# Altium project PCB_Project.PrjPcb
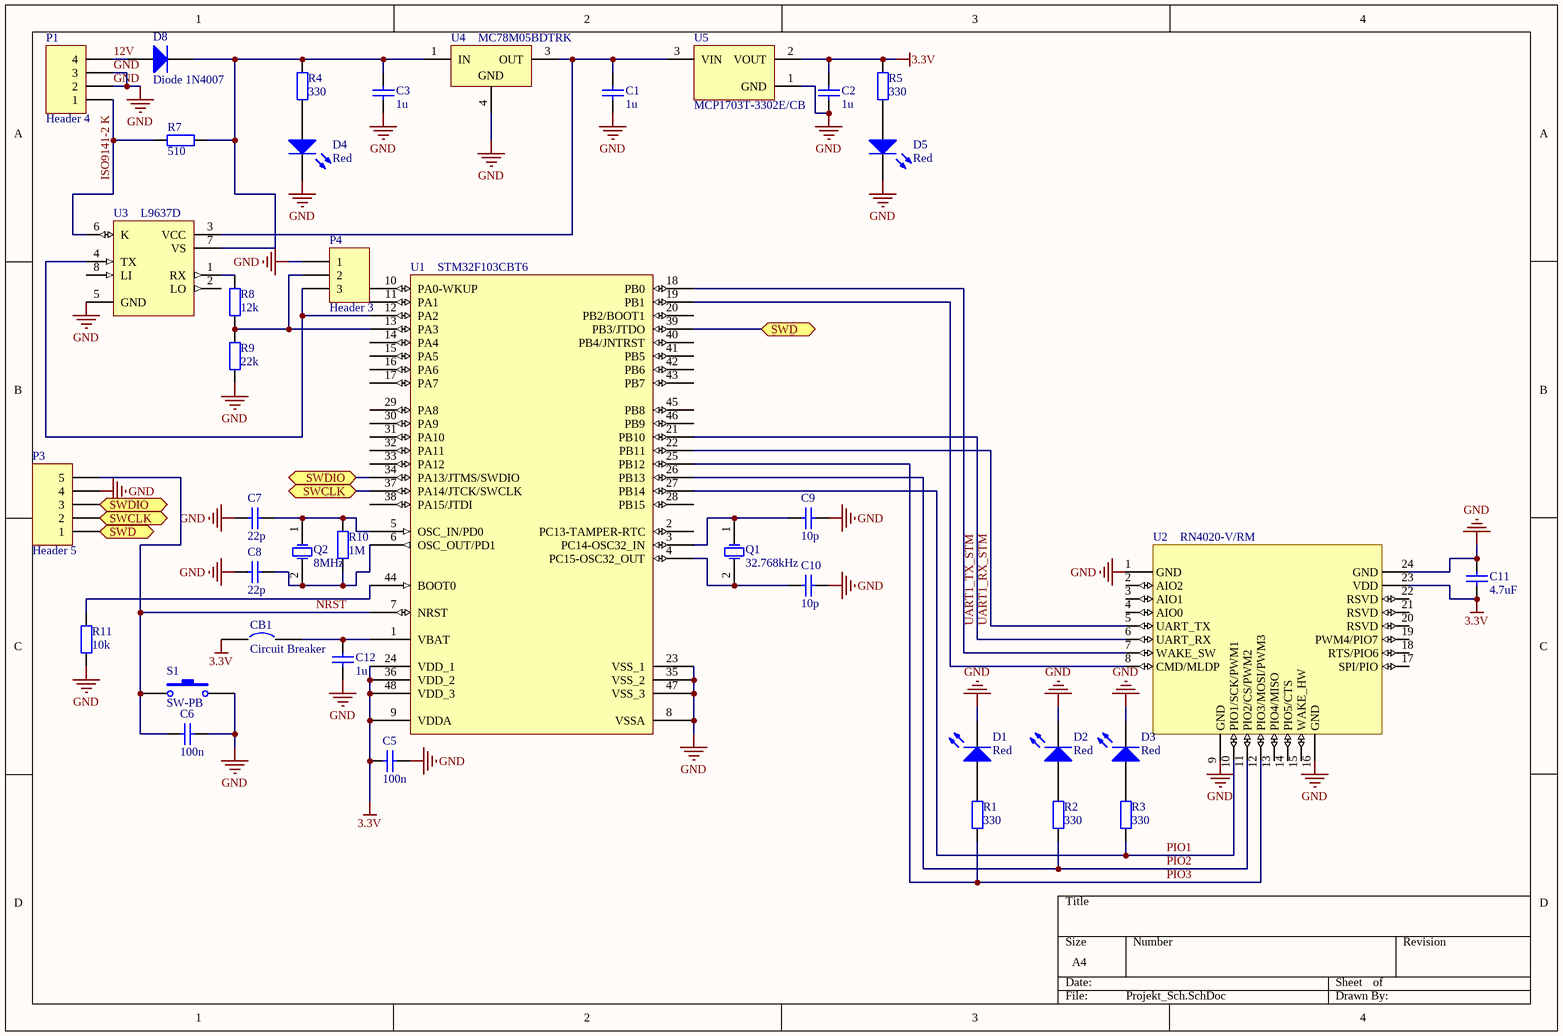
[diagram p0: Projekt_Sch.SchDoc]
1 sheet, 39 parts. Net scope: flat (ports and power ports of the same name join across sheets).
Board file: Projekt_Pcb.PcbDoc

## Sheet Projekt_Sch.SchDoc
size A4

### Parts
C1  1u  [0402]
C2  1u  [0402]
C3  1u  [0603]
C5  100n  [0402]
C6  100n  [0402]
C7  22p  [0402]
C8  22p  [0402]
C9  10p  [0402]
C10  10p  [0402]
C11  4.7uF  [0402]
C12  1u  [0402]
CB1  Circuit Breaker  [SPST-2]
D1  Red  [0402]
D2  Red  [0402]
D3  Red  [0402]
D4  Red  [0402]
D5  Red  [0402]
D8  Diode 1N4007  [DO-41]
P1  Header 4  [HDR1X4]
P3  Header 5  [HDR1X5]
P4  Header 3  [HDR1X3]
Q1  32.768kHz  [Kwarc]
Q2  8MHz  [HC-49U]
R1  330  [0402]
R2  330  [0402]
R3  330  [0402]
R4  330  [0402]
R5  330  [0402]
R7  510  [0402]
R8  12k  [0402]
R9  22k  [0402]
R10  1M  [0402]
R11  10k  [0402]
S1  SW-PB  [SPST-2]
U1  STM32F103CBT6  [LQFP48_N]
U2  RN4020-V/RM  [RN4020_ALT]
U3  L9637D  [SO8_N]
U4  MC78M05BDTRK  [369A-13]
U5  MCP1703T-3302E/CB  [SOT-23A-CB3_N]

### Ports
SWCLK (bidir), SWD (bidir), SWDIO (bidir)

### Nets
3.3V: C2.2 C5.2 C11.1 CB1.1 R5.2 U1.9(VDDA) U1.24(VDD_1) U1.36(VDD_2) U1.48(VDD_3) U2.23(VDD) U5.2(VOUT)
GND: C1.1 C2.1 C3.1 C5.1 C6.1 C7.2 C8.2 C9.1 C10.1 C11.2 C12.1 D1.2(K) D2.2(K) D3.2(K) D4.2(K) D5.2(K) P1.2 P1.3 P3.4 P4.1 R9.1 R11.2 S1.2 U1.8(VSSA) U1.23(VSS_1) U1.35(VSS_2) U1.47(VSS_3) U2.1(GND) U2.9(GND) U2.16(GND) U2.24(GND) U3.5(GND) U4.4(GND) U5.1(GND)
12V: D8.1(A) P1.4
ISO9141-2 K: P1.1 R7.2 U3.6(K)
NRST: C6.2 P3.5 S1.1 U1.7(NRST)
PIO1: R3.2 U1.27(PB14) U2.10(PIO1/SCK/PWM1)
PIO2: R2.2 U1.26(PB13) U2.11(PIO2/CS/PWM2)
PIO3: R1.2 U1.25(PB12) U2.12(PIO3/MOSI/PWM3)
UART1_RX_STM: U1.22(PB11) U2.5(UART_TX)
UART1_TX_STM: U1.21(PB10) U2.6(UART_RX)
NetC1_2: C1.2 U3.3(VCC) U4.3(OUT) U5.3(VIN)
NetC3_2: C3.2 D8.2(K) R4.2 R7.1 U3.7(VS) U4.1(IN)
NetC7_1: C7.1 Q2.1(OSC1) R10.2 U1.5(OSC_IN/PD0)
NetC8_1: C8.1 Q2.2(OSC2) R10.1 U1.6(OSC_OUT/PD1)
NetC9_2: C9.2 Q1.1(OSC1) U1.3(PC14-OSC32_IN)
NetC10_2: C10.2 Q1.2(OSC2) U1.4(PC15-OSC32_OUT)
NetC12_2: C12.2 CB1.2 U1.1(VBAT)
NetD1_1: D1.1(A) R1.1
NetD2_1: D2.1(A) R2.1
NetD3_1: D3.1(A) R3.1
NetD4_1: D4.1(A) R4.1
NetD5_1: D5.1(A) R5.1
NetP3_1: P3.1 U1.39(PB3/JTDO) ; port SWD
NetP3_2: P3.2 U1.37(PA14/JTCK/SWCLK) ; port SWCLK
NetP3_3: P3.3 U1.34(PA13/JTMS/SWDIO) ; port SWDIO
NetP4_2: P4.2 R8.1 R9.2 U1.13(PA3)
NetP4_3: P4.3 U1.12(PA2) U3.4(TX)
NetR8_2: R8.2 U3.1(RX)
NetR11_1: R11.1 U1.44(BOOT0)
NetU1_18: U1.18(PB0) U2.7(WAKE_SW)
NetU1_19: U1.19(PB1) U2.8(CMD/MLDP)

Not connected (* = marked no-connect by the designer): U1 2(PC13-TAMPER-RTC) 10(PA0-WKUP) 11(PA1) 14(PA4) 15(PA5) 16(PA6) 17(PA7) 20(PB2/BOOT1) 28(PB15) 29(PA8) 30(PA9) 31(PA10) 32(PA11) 33(PA12) 38(PA15/JTDI) 40(PB4/JNTRST) 41(PB5) 42(PB6) 43(PB7) 45(PB8) 46(PB9); U2 2(AIO2) 3(AIO1) 4(AIO0) 13(PIO4/MISO) 14(PIO5/CTS) 15(WAKE_HW) 17(SPI/PIO) 18(RTS/PIO6) 19(PWM4/PIO7) 20(RSVD) 21(RSVD) 22(RSVD); U3 2(LO) 8(LI)

### Library data of the parts
C1-C3 C5-C12 = Cap: Capacitor; Published: 8-Jun-2000; LatestRevisionDate: 17-Jul-2002; LatestRevisionNote: Re-released for DXP Platform.; PackageReference: RAD-0.3; Publisher: Altium Limited; PackageDescription: Radial Cap, Thru-Hole; 2 Leads; 0.3 in Pin Spacing
  C1-C3 C12: Value: 1u
  C5 C6: Value: 100n
  C7 C8: Value: 22p
  C9 C10: Value: 10p
  C11: Value: 4.7uF
D1-D5 = LED2: Typical RED, GREEN, YELLOW, AMBER GaAs LED; Published: 8-Jun-2000; LatestRevisionDate: 17-Jul-2002; LatestRevisionNote: Re-released for DXP Platform.; PackageVersion: Feb-2002; PackageReference: 3.2X1.6X1.1; Publisher: Altium Limited; PackageDescription: SM LED; 2 Flat Leads
D8 = Diode 1N4007: 1 Amp General Purpose Rectifier; Published: 8-Jun-2000; LatestRevisionDate: 17-Jul-2002; LatestRevisionNote: Re-released for DXP Platform.; DatasheetVersion: 1998; PackageVersion: Aug-1999; PackageReference: DO-41; Publisher: Altium Limited; PackageDescription: Diode, Axial; Body 5.2 x 2.7 mm (LxDia. max), Lead Dia. 0.86 mm (max); Code_JEDEC: DO-204-AL; ComponentLink1Description: Manufacturer Link; ComponentLink1URL: http://www.fairchildsemi.com/; ComponentLink2Description: Datasheet; ComponentLink2URL: http://www.fairchildsemi.com/ds/1N%2F1N4001.pdf
P1 = Header 4: Header, 4-Pin; LatestRevisionDate: 17-Jul-2002; LatestRevisionNote: Re-released for DXP Platform.; Publisher: Altium Limited
P3 = Header 5: Header, 5-Pin; LatestRevisionDate: 17-Jul-2002; LatestRevisionNote: Re-released for DXP Platform.; Publisher: Altium Limited
P4 = Header 3: Header, 3-Pin; LatestRevisionDate: 17-Jul-2002; LatestRevisionNote: Re-released for DXP Platform.; Publisher: Altium Limited
Q1 = XTAL: Crystal Oscillator; Published: 8-Jun-2000; LatestRevisionDate: 17-Jul-2002; LatestRevisionNote: Re-released for DXP Platform.; PackageReference: R38; Publisher: Altium Limited; PackageDescription: Crystal, Thru-Hole; 2 Leads; Body 3.1 x 8.2 mm (Dia.xH)
Q2 = ECS-10-13-1: Crystal Oscillator; Published: 17-Jul-2002; DatasheetDocument: 18-Apr-2000; PackageReference: HC-49U; Publisher: Altium Limited; ComponentLink1Description: Manufacturer Link; ComponentLink1URL: http://www.ecsxtal.com/; ComponentLink2Description: Datasheet; ComponentLink2URL: http://www.ecsxtal.com/pdf2/HC49U.PDF
R1-R5 R7-R11 = Res2: Resistor; Published: 8-Jun-2000; LatestRevisionDate: 17-Jul-2002; LatestRevisionNote: Re-released for DXP Platform.; PackageReference: AXIAL-0.4; Publisher: Altium Limited; PackageDescription: Axial Device, Thru-Hole; 2 Leads; 0.4 in Pin Spacing
  R1-R5: Value: 330
  R7: Value: 510
  R8: Value: 12k
  R9: Value: 22k
  R10: Value: 1M
  R11: Value: 10k
S1 = SW-PB: Switch; Published: 24-Mar-1999; LatestRevisionDate: 17-Jul-2002; LatestRevisionNote: Re-released for DXP Platform.; PackageReference: SPST-2; Publisher: Altium Limited; PackageDescription: Switch; 2 Leads
U1 = STM32F103CBT6: STM32 ARM-based 32-bit MCU with 128 Kbytes Flash, 48-pin LQFP, Industrial Temperature; Published: 30-May-2008; DatasheetVersion: rev6, Mar-2008; PackageVersion: Mar-2008; PackageReference: LQFP48; Publisher: Altium Limited; PackageDescription: 48-Pin Low-Profile Quad Flat Pack, 7 x 7 mm Body, 0.5 mm Pitch (LQFP48); ComponentLink1Description: Manufacturer Link; ComponentLink1URL: www.st.com/stm32; ComponentLink2Description: Datasheet; ComponentLink2URL: http://www.st.com/stonline/products/literature/ds/13587.pdf
U2 = RN2020-V/RM123: Microchip RN4020 Bluetooth
U3 = L9637D: ISO 9141 Interface; Published: 24-Aug-2001; LatestRevisionDate: 13-Apr-2006; LatestRevisionNote: IPC-7351 Footprint Added.; DatasheetVersion: Dec-1998; PackageVersion: Dec-2002; PackageReference: SO8; Publisher: Altium Limited; PackageDescription: 8-Pin Small Outline Integrated Circuit 1.27 mm Pitch; Code_JEDEC: MS-012-AA; Code_IPC: SOIC127P600-8; ComponentLink1Description: Manufacturer Link; ComponentLink1URL: http://www.st.com/; ComponentLink2Description: Datasheet; ComponentLink2URL: http://www.st.com/stonline/products/literature/ds/1765/l9637.pdf
U4 = MC78M05BDTRK: Three-Terminal Medium Current Positive Voltage Regulator; Note: Pin 2 is electrically connected to Pin 4; Pin 2 is trimmed and not drawn;; Published: 15-Apr-2002; DatasheetVersion: Apr-2000; PackageVersion: 1997; PackageReference: 369A-13; Publisher: Altium Limited; PackageDescription: D-PAK/TO-252-AA; 3 Leads (1 Cropped); Body 10.3 (inc. leads) x 6.7 mm (LxW max); ComponentLink1Description: Manufacturer Link; ComponentLink1URL: http://www.onsemi.com/site/products/taxonomy/0,4438,503,00.html; ComponentLink2Description: Datasheet; ComponentLink2URL: http://www.onsemi.com/pub/Collateral/MC78M00-D.PDF
U5 = MCP1703T-3302E/CB: 250 mA, 16V, Low Quiescent Current LDO Regulator, 3-Pin SOT-23A, Extended Temperature, Tape and Reel; Published: 29-Jan-2009; DatasheetVersion: revD, Sep-2009; PackageVersion: revBB, Aug-2009; PackageReference: SOT-23A-CB3; Publisher: Altium Limited; PackageDescription: 3-Lead Plastic Small Outline Transistor (CB) [SOT-23A]; Supplier 1: Digi-Key; Supplier Part Number 1: MCP1703T-3302E/CBTR-ND; Supplier 2: Digi-Key; Supplier Part Number 2: MCP1703T-3302E/CBCT-ND; Supplier 3: Digi-Key; Supplier Part Number 3: MCP1703T-3302E/CBDKR-ND; Supplier 4: Farnell; Supplier Part Number 4: 1439518; ComponentLink1Description: Datasheet; ComponentLink1URL: http://ww1.microchip.com/downloads/en/DeviceDoc/22049d.pdf; ComponentLink2Description: Packaging Specification; ComponentLink2URL: http://www.microchip.com/stellent/groups/techpub_sg/documents/packagingspec/en012702.pdf; ComponentLink3Description: Microchip.com Home; ComponentLink3URL: http://www.microchip.com/
CB1 = Circuit Breaker: Published: 24-Mar-1999; LatestRevisionDate: 17-Jul-2002; LatestRevisionNote: Re-released for DXP Platform.; PackageReference: SPST-2; Publisher: Altium Limited; PackageDescription: Switch; 2 Leads